# Altium schematic sheet Mother Board Ethernet.SchDoc
size A4
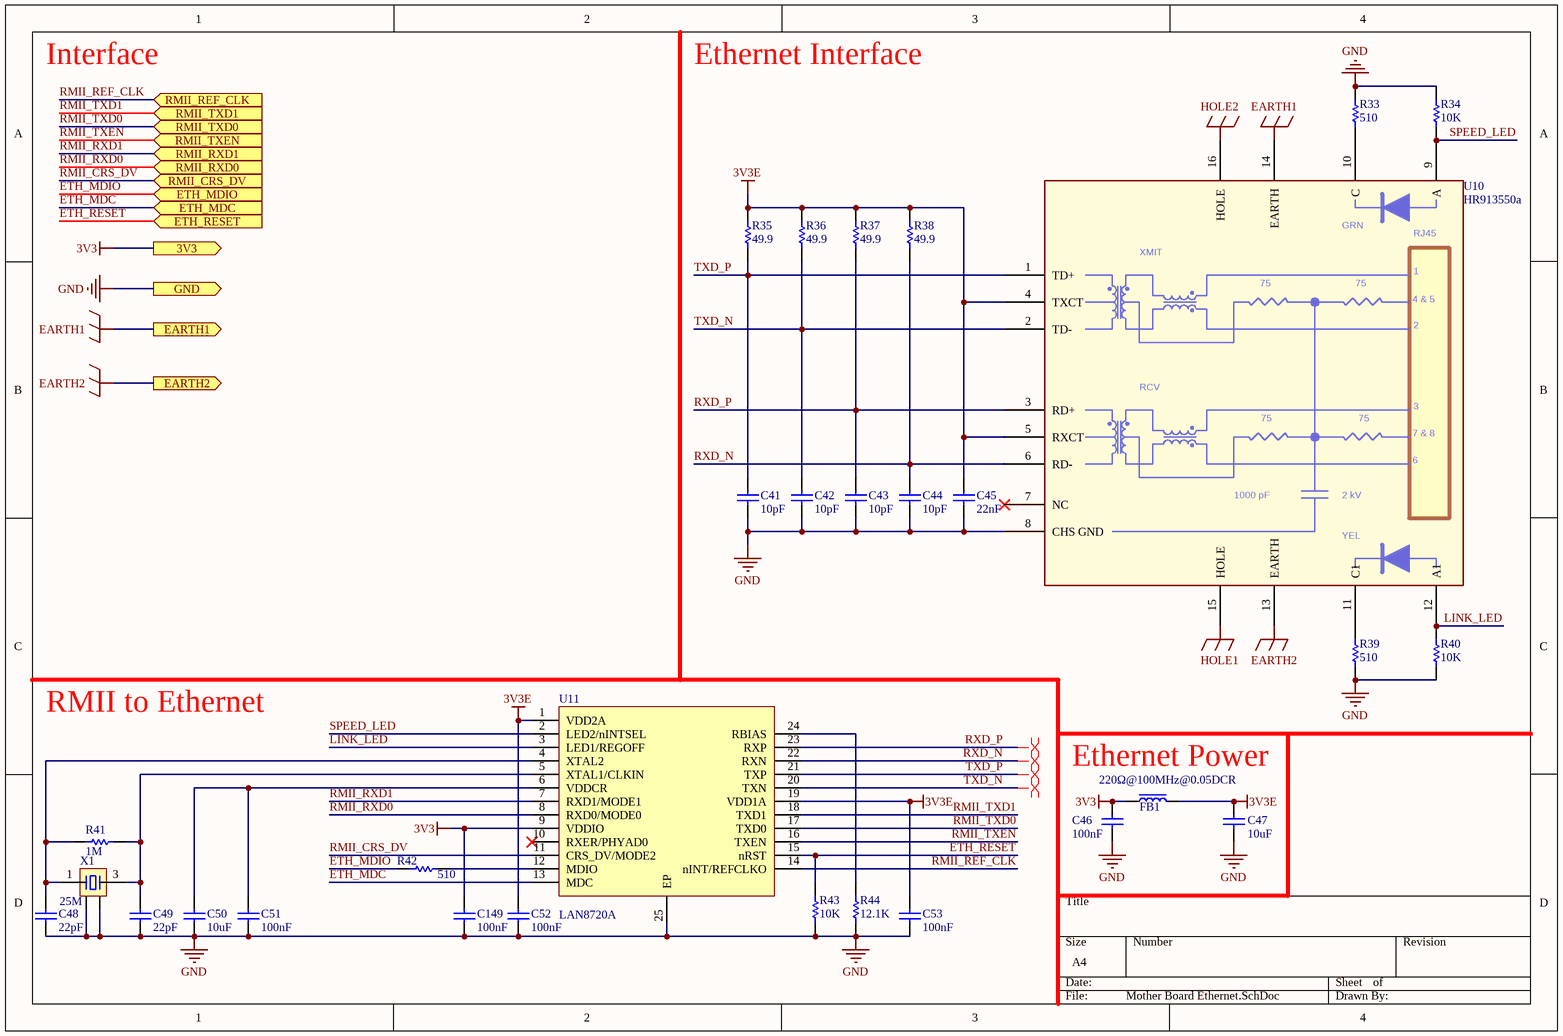
[diagram p0: Mother Board Ethernet.SchDoc]

## Parts
C41  10pF  [C0603]
C42  10pF  [C0603]
C43  10pF  [C0603]
C44  10pF  [C0603]
C45  22nF  [C0603]
C46  100nF  [C0603]
C47  10uF  [C0603]
C48  22pF  [C0603]
C49  22pF  [C0603]
C50  10uF  [C0603]
C51  100nF  [C0603]
C52  100nF  [C0603]
C53  100nF  [C0603]
C149  100nF  [C0603]
FB1  220Ω@100MHz@0.05DCR  [FB 0603]
R33  510  [R0603]
R34  10K  [R0603]
R35  49.9  [R0603]
R36  49.9  [R0603]
R37  49.9  [R0603]
R38  49.9  [R0603]
R39  510  [R0603]
R40  10K  [R0603]
R41  1M  [R0603]
R42  510  [R0603]
R43  10K  [R0603]
R44  12.1K  [R0603]
U10  HR913550a  [RJ45-TH_HR913550A]
U11  LAN8720A  [QFN24]
X1  25M  [XTAL-3225]

## Ports
3V3 (out), EARTH1 (out), EARTH2 (out), ETH_MDC (in), ETH_MDIO (in), ETH_RESET (in), GND (out), RMII_CRS_DV (in), RMII_REF_CLK (in), RMII_RXD0 (in), RMII_RXD1 (in), RMII_TXD0 (in), RMII_TXD1 (in), RMII_TXEN (in)

## Nets
3V3: C46.2 C149.1 FB1.1 U11.9(VDDIO) ; port 3V3
3V3E: C45.2 C47.2 C52.1 C53.1 FB1.2 R35.2 R36.2 R37.2 R38.2 U10.4(TXCT) U10.5(RXCT) U11.1(VDD2A) U11.19(VDD1A)
EARTH1: U10.14(EARTH) ; port EARTH1
EARTH2: U10.13(EARTH) ; port EARTH2
GND: C41.1 C42.1 C43.1 C44.1 C45.1 C46.1 C47.1 C48.2 C49.2 C50.2 C51.2 C52.2 C53.2 C149.2 R33.1 R34.1 R39.1 R40.1 R43.2 R44.1 U10.8(CHS_GND) U11.25(EP) X1.2 X1.4 ; port GND
HOLE1: U10.15(HOLE)
HOLE2: U10.16(HOLE)
ETH_MDC: U11.13(MDC) ; port ETH_MDC
ETH_MDIO: R42.1 ; port ETH_MDIO
ETH_RESET: R43.1 U11.15(nRST) ; port ETH_RESET
LINK_LED: R40.2 U10.12(A1) U11.3(LED1/REGOFF)
RMII_CRS_DV: U11.11(CRS_DV/MODE2) ; port RMII_CRS_DV
RMII_REF_CLK: U11.14(nINT/REFCLKO) ; port RMII_REF_CLK
RMII_RXD0: U11.8(RXD0/MODE0) ; port RMII_RXD0
RMII_RXD1: U11.7(RXD1/MODE1) ; port RMII_RXD1
RMII_TXD0: U11.17(TXD0) ; port RMII_TXD0
RMII_TXD1: U11.18(TXD1) ; port RMII_TXD1
RMII_TXEN: U11.16(TXEN) ; port RMII_TXEN
RXD_N: C44.2 R38.1 U10.6(RD-) U11.22(RXN)
RXD_P: C43.2 R37.1 U10.3(RD+) U11.23(RXP)
SPEED_LED: R34.2 U10.9(A) U11.2(LED2/nINTSEL)
TXD_N: C42.2 R36.1 U10.2(TD-) U11.20(TXN)
TXD_P: C41.2 R35.1 U10.1(TD+) U11.21(TXP)
NetC48_1: C48.1 R41.2 U11.4(XTAL2) X1.1
NetC49_1: C49.1 R41.1 U11.5(XTAL1/CLKIN) X1.3
NetC50_1: C50.1 C51.1 U11.6(VDDCR)
NetR33_2: R33.2 U10.10(C)
NetR39_2: R39.2 U10.11(C1)
NetR42_2: R42.2 U11.12(MDIO)
NetR44_2: R44.2 U11.24(RBIAS)

Not connected (* = marked no-connect by the designer): U10 7(NC)*; U11 10(RXER/PHYAD0)*

## Layout directives
differential pair: RXD_N, RXD_P, TXD_N, TXD_P

## Notes on the sheet
- Interface
- Ethernet Interface
- RMII to Ethernet
- Ethernet Power
- (in symbol HR913550a) GRN; RJ45; XMIT; 75; 4 & 5; RCV; 7 & 8; 1000 pF; 2 kV; YEL

## Library data of the parts
C41-C53 C149 = Cap
FB1 = FB: 磁珠
R33-R44 = RES
U11 = LAN8720A: RMII Ethernet 网口芯片
X1 = XTAL-4: 4脚晶振; 版权归属: 源创客; BOM名称: 4脚晶振; 学习资源: www.ooocke.com
U10 = HR913550a: HR911205C_A: *; HR911205C_B: *